# Altium schematic sheet child1.SchDoc
size A3
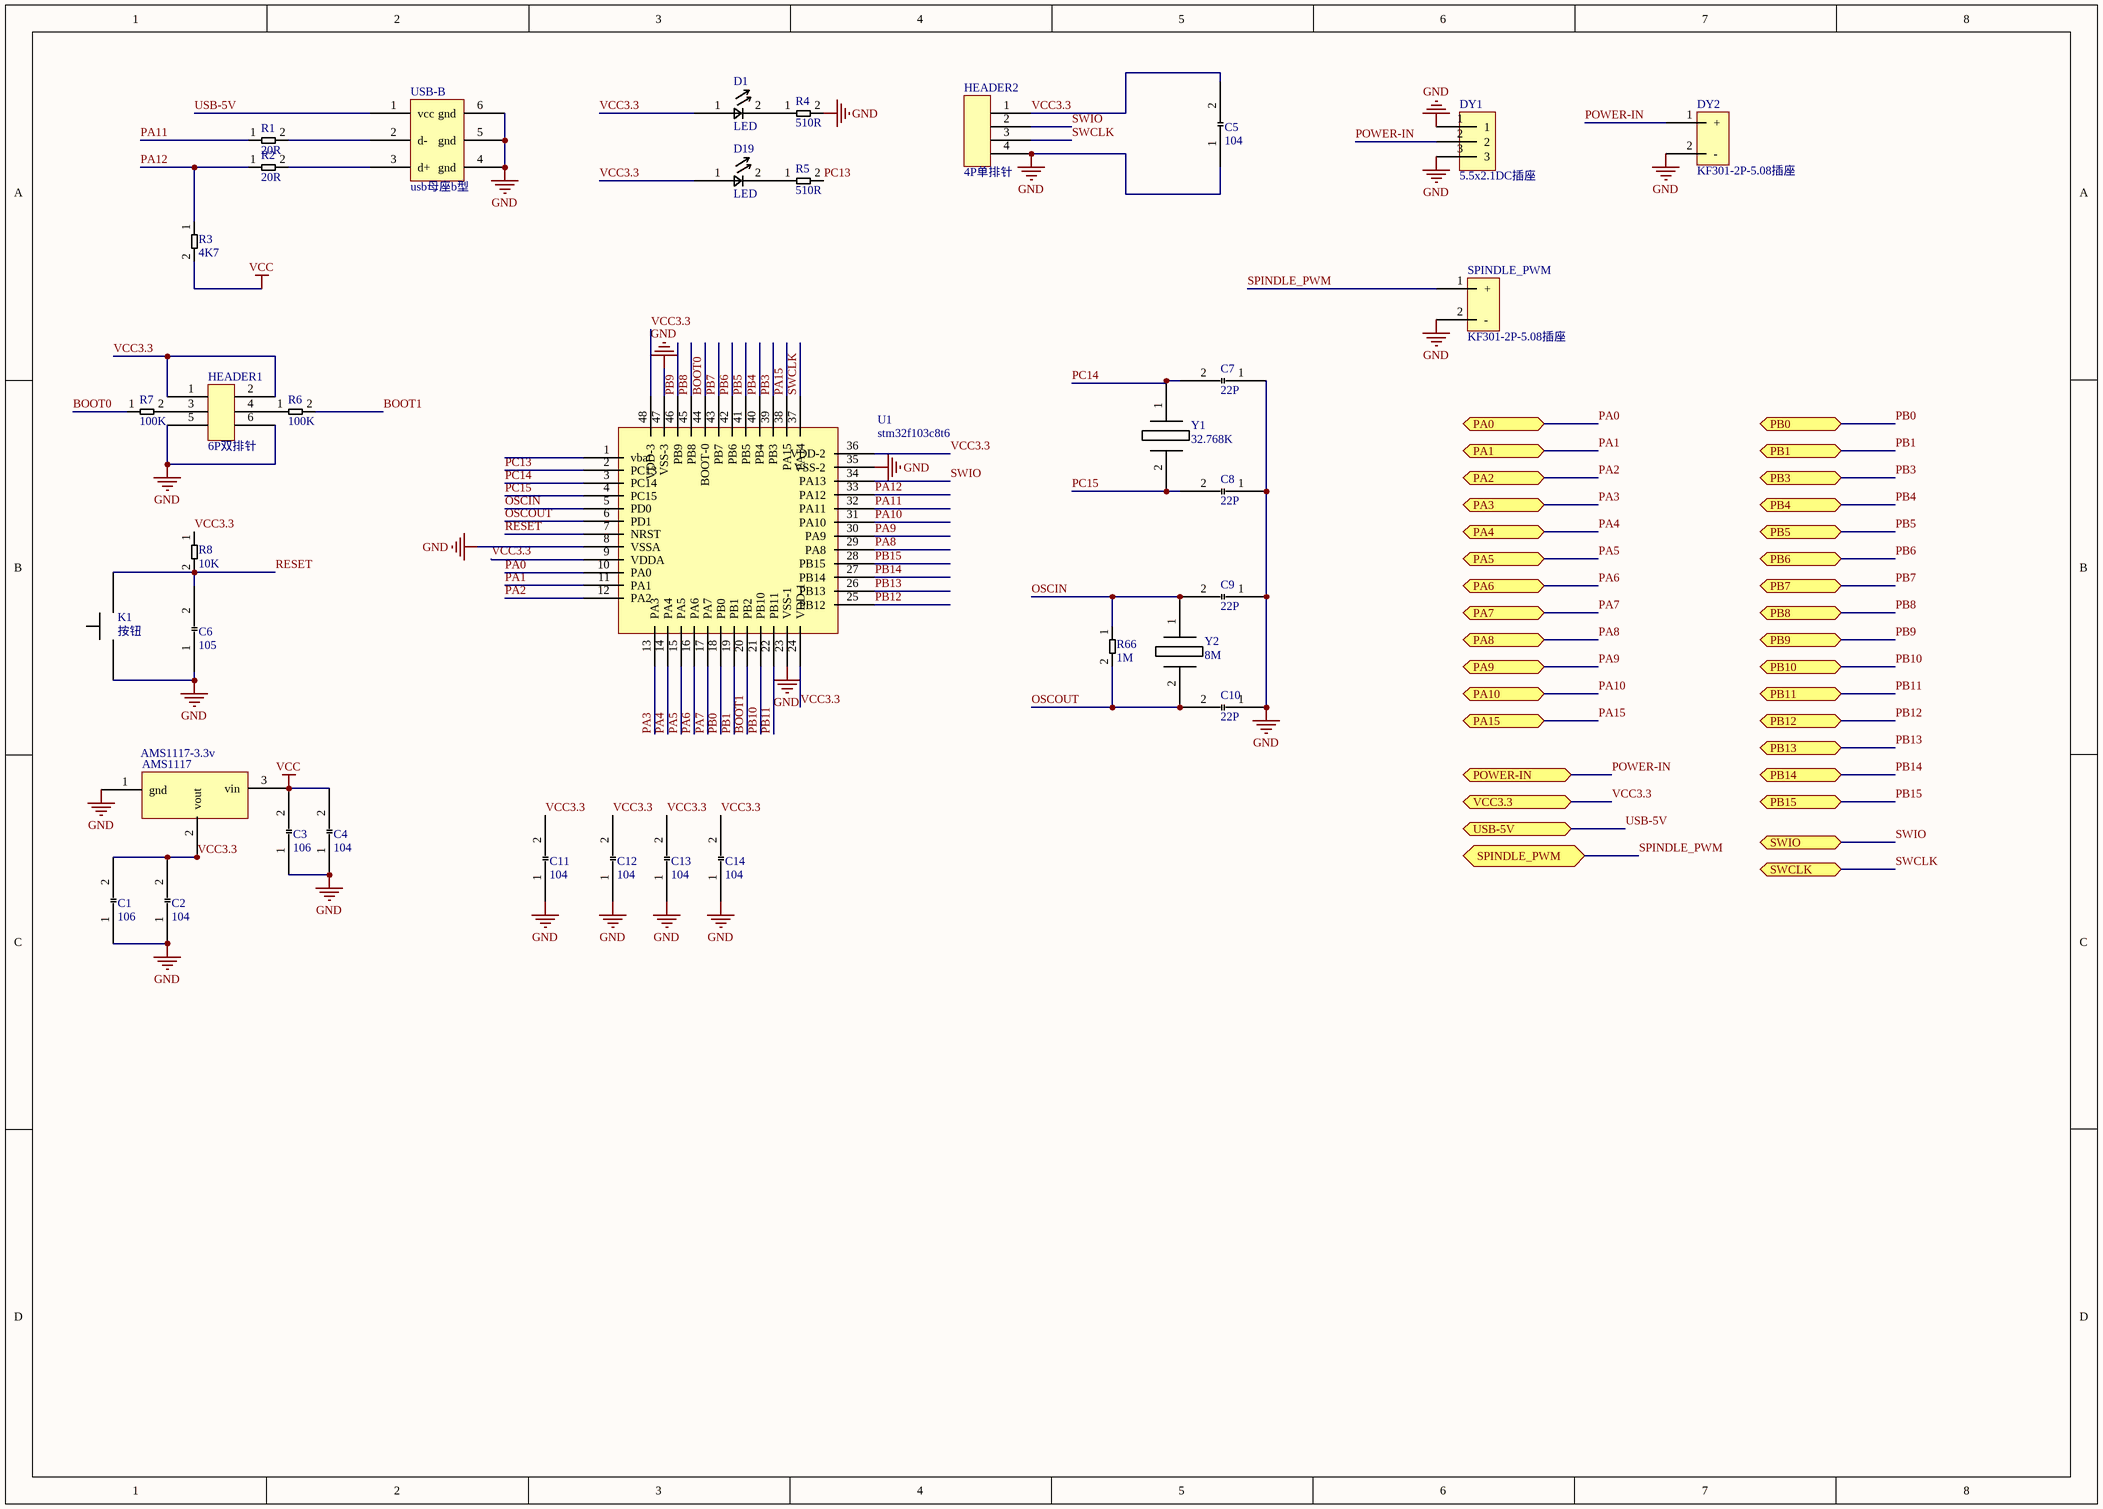
[diagram p0: child1.SchDoc]

## Parts
AMS1117  AMS1117-3.3v  [AMS1117-3.3v-sot223]
C1  106  [0805电容]
C2  104  [0805电容]
C3  106  [0805电容]
C4  104  [0805电容]
C5  104  [0805电容]
C6  105  [0805电容]
C7  22P  [0805电容]
C8  22P  [0805电容]
C9  22P  [0805电容]
C10  22P  [0805电容]
C11  104  [0805电容]
C12  104  [0805电容]
C13  104  [0805电容]
C14  104  [0805电容]
D1  LED  [0805二极管]
D19  LED  [0805二极管]
DY1  5.5x2.1DC插座  [5.5x2.1DC插座]
DY2  KF301-2P-5.08插座  [KF301-2P-5.08插座]
HEADER1  6P双排针  [6P双排针]
HEADER2  4P单排针  [4p单排针]
K1  按钮  [3x4贴片按钮]
R1  20R  [0805电阻]
R2  20R  [0805电阻]
R3  4K7  [0805电阻]
R4  510R  [0805电阻]
R5  510R  [0805电阻]
R6  100K  [0805电阻]
R7  100K  [0805电阻]
R8  10K  [0805电阻]
R66  1M  [0805电阻]
SPINDLE_PWM  KF301-2P-5.08插座  [KF301-2P-5.08插座]
U1  stm32f103c8t6  [lqfp48]
USB-B  usb母座b型  [usb母座b型]
Y1  32.768K  [3.2x1.5晶振]
Y2  8M  [8M贴片晶振]

## Ports
PA0 (bidir), PA1 (bidir), PA2 (bidir), PA3 (bidir), PA4 (bidir), PA5 (bidir), PA6 (bidir), PA7 (bidir), PA8 (bidir), PA9 (bidir), PA10 (bidir), PA15 (bidir), PB0 (bidir), PB1 (bidir), PB3 (bidir), PB4 (bidir), PB5 (bidir), PB6 (bidir), PB7 (bidir), PB8 (bidir), PB9 (bidir), PB10 (bidir), PB11 (bidir), PB12 (bidir), PB13 (bidir), PB14 (bidir), PB15 (bidir), POWER-IN (bidir), SPINDLE_PWM (bidir), SWCLK (bidir), SWIO (bidir), USB-5V (bidir), VCC3.3 (bidir)

## Nets
GND: AMS1117.1(gnd) C1.1 C2.1 C3.1 C4.1 C5.1 C6.1 C7.1 C8.1 C9.1 C10.1 C11.1 C12.1 C13.1 C14.1 DY1.1 DY1.3 DY2.2(-) HEADER1.5 HEADER1.6 HEADER2.4 K1.2 R4.2 SPINDLE_PWM.2(-) U1.8(VSSA) U1.23(VSS-1) U1.35(VSS-2) U1.47(VSS-3) USB-B.4(gnd) USB-B.5(gnd) USB-B.6(gnd)
VCC: AMS1117.3(vin) C3.2 C4.2 R3.2
BOOT0: R7.1 U1.44(BOOT-0)
BOOT1: R6.2 U1.20(PB2)
OSCIN: C9.2 R66.1 U1.5(PD0) Y2.1
OSCOUT: C10.2 R66.2 U1.6(PD1) Y2.2
PA0: U1.10(PA0) ; port PA0
PA1: U1.11(PA1) ; port PA1
PA2: U1.12(PA2) ; port PA2
PA3: U1.13(PA3) ; port PA3
PA4: U1.14(PA4) ; port PA4
PA5: U1.15(PA5) ; port PA5
PA6: U1.16(PA6) ; port PA6
PA7: U1.17(PA7) ; port PA7
PA8: U1.29(PA8) ; port PA8
PA9: U1.30(PA9) ; port PA9
PA10: U1.31(PA10) ; port PA10
PA11: R1.1 U1.32(PA11)
PA12: R2.1 R3.1 U1.33(PA12)
PA15: U1.38(PA15) ; port PA15
PB0: U1.18(PB0) ; port PB0
PB1: U1.19(PB1) ; port PB1
PB3: U1.39(PB3) ; port PB3
PB4: U1.40(PB4) ; port PB4
PB5: U1.41(PB5) ; port PB5
PB6: U1.42(PB6) ; port PB6
PB7: U1.43(PB7) ; port PB7
PB8: U1.45(PB8) ; port PB8
PB9: U1.46(PB9) ; port PB9
PB10: U1.21(PB10) ; port PB10
PB11: U1.22(PB11) ; port PB11
PB12: U1.25(PB12) ; port PB12
PB13: U1.26(PB13) ; port PB13
PB14: U1.27(PB14) ; port PB14
PB15: U1.28(PB15) ; port PB15
PC13: R5.2 U1.2(PC13)
PC14: C7.2 U1.3(PC14) Y1.1
PC15: C8.2 U1.4(PC15) Y1.2
POWER-IN: DY1.2 DY2.1(+) ; port POWER-IN
RESET: C6.2 K1.1 R8.2 U1.7(NRST)
SPINDLE_PWM: SPINDLE_PWM.1(+) ; port SPINDLE_PWM
SWCLK: HEADER2.3 U1.37(PA14) ; port SWCLK
SWIO: HEADER2.2 U1.34(PA13) ; port SWIO
USB-5V: USB-B.1(vcc) ; port USB-5V
VCC3.3: AMS1117.2(vout) C1.2 C2.2 C5.2 C11.2 C12.2 C13.2 C14.2 D1.1 D19.1 HEADER1.1 HEADER1.2 HEADER2.1 R8.1 U1.9(VDDA) U1.24(VDD-1) U1.36(VDD-2) U1.48(VDD-3) ; port VCC3.3
NetD1_2: D1.2 R4.1
NetD19_2: D19.2 R5.1
NetHEADER1_3: HEADER1.3 R7.2
NetHEADER1_4: HEADER1.4 R6.1
NetR1_2: R1.2 USB-B.2(d-)
NetR2_2: R2.2 USB-B.3(d+)

Not connected (* = marked no-connect by the designer): U1 1(vbat)

## Library data of the parts
C1-C14 = 0805贴片电容
D1 D19 = 0805贴片发光二极管
K1 = 3x4贴片按钮
R1-R8 R66 = 0805贴片电阻
Y1 Y2 = 2脚贴片晶振